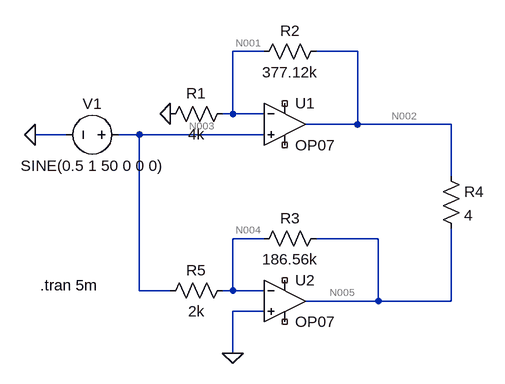
[diagram p0: schematic Draft1.asc]
Draft1.asc, the LTspice schematic file:
Version 4.1
SHEET 1 880 680
WIRE 304 48 256 48
WIRE 448 48 384 48
WIRE 256 144 256 48
WIRE 256 144 240 144
WIRE 304 144 256 144
WIRE 448 160 448 48
WIRE 448 160 368 160
WIRE 592 160 448 160
WIRE 0 176 -48 176
WIRE 112 176 80 176
WIRE 304 176 112 176
WIRE 592 240 592 160
WIRE 304 336 256 336
WIRE 480 336 384 336
WIRE 112 416 112 176
WIRE 160 416 112 416
WIRE 256 416 256 336
WIRE 256 416 240 416
WIRE 304 416 256 416
WIRE 480 432 480 336
WIRE 480 432 368 432
WIRE 592 432 592 320
WIRE 592 432 480 432
WIRE 304 448 256 448
WIRE 256 512 256 448
FLAG 160 144 0
FLAG 256 512 0
FLAG -48 176 0
SYMBOL voltage 96 176 R90
WINDOW 0 -32 56 VBottom 2
WINDOW 3 32 56 VTop 2
WINDOW 123 0 0 Left 0
WINDOW 39 0 0 Left 0
SYMATTR InstName V1
SYMATTR Value SINE(0.5 1 50 0 0 0)
SYMBOL OpAmps\\OP07 336 96 R0
SYMATTR InstName U1
SYMBOL res 256 128 R90
WINDOW 0 0 56 VBottom 2
WINDOW 3 32 56 VTop 2
SYMATTR InstName R1
SYMATTR Value 4k
SYMBOL res 400 32 R90
WINDOW 0 0 56 VBottom 2
WINDOW 3 32 56 VTop 2
SYMATTR InstName R2
SYMATTR Value 377.12k
SYMBOL OpAmps\\OP07 336 368 R0
SYMATTR InstName U2
SYMBOL res 400 320 R90
WINDOW 0 0 56 VBottom 2
WINDOW 3 32 56 VTop 2
SYMATTR InstName R3
SYMATTR Value 186.56k
SYMBOL res 576 224 R0
SYMATTR InstName R4
SYMATTR Value 4
SYMBOL res 256 400 R90
WINDOW 0 0 56 VBottom 2
WINDOW 3 32 56 VTop 2
SYMATTR InstName R5
SYMATTR Value 2k
TEXT -40 408 Left 2 !.tran 5m

The netlist it stands for:
* Draft1.asc
V1 N003 0 SINE(0.5 1 50 0 0 0)
X§U1 N003 N001 NC_01 NC_02 N002 LT1001  ; OP07, pins In+ In- V+ V- OUT
R1 N001 0 4k
R2 N002 N001 377.12k
X§U2 0 N004 NC_03 NC_04 N005 LT1001  ; OP07, pins In+ In- V+ V- OUT
R3 N005 N004 186.56k
R4 N002 N005 4
R5 N004 N003 2k
.tran 5m
.lib LTC.lib
.backanno
.end

* Results of the author's LTspice run, read from the files saved beside the schematic
* Operating Point, zero values left out:
*   V(n001) = 3.934 mV
*   V(n002) = 372.3 mV
*   V(n003) = 500 mV
*   V(n004) = 498.6 mV
*   V(n005) = 372.3 mV
*   I(R1) = 983.5 nA
*   I(R2) = 976.8 nA
*   I(R3) = -677.1 nA
*   I(R4) = -818.6 nA
*   I(R5) = -683.9 nA
*   I(V1) = -690.6 nA
*   Ix(u1:1) = 6.697 nA
*   Ix(u1:2) = -6.698 nA
*   Ix(u1:5) = -158.2 nA
*   Ix(u2:1) = -6.732 nA
*   Ix(u2:2) = 6.732 nA
*   Ix(u2:5) = -141.4 nA